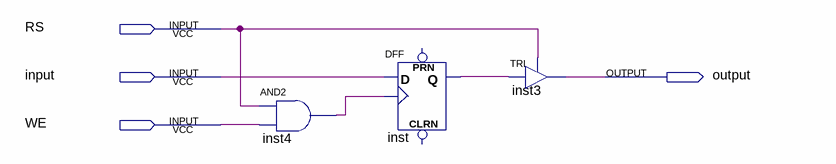
[diagram p0: schematic sheet]
// Quartus schematic memory_cell.bdf as structural Verilog: 3 symbols, 4 pins
module memory_cell (
  input  RS,
  input  \input ,
  input  WE,
  output \output 
);

  wire inst4_out, inst_q;

  and inst4 (inst4_out, RS, WE);
  DFF inst (.CLK(inst4_out), .D(\input ), .Q(inst_q));  // open: CLRN, PRN
  TRI inst3 (.IN(inst_q), .OE(RS), .OUT(\output ));
endmodule
